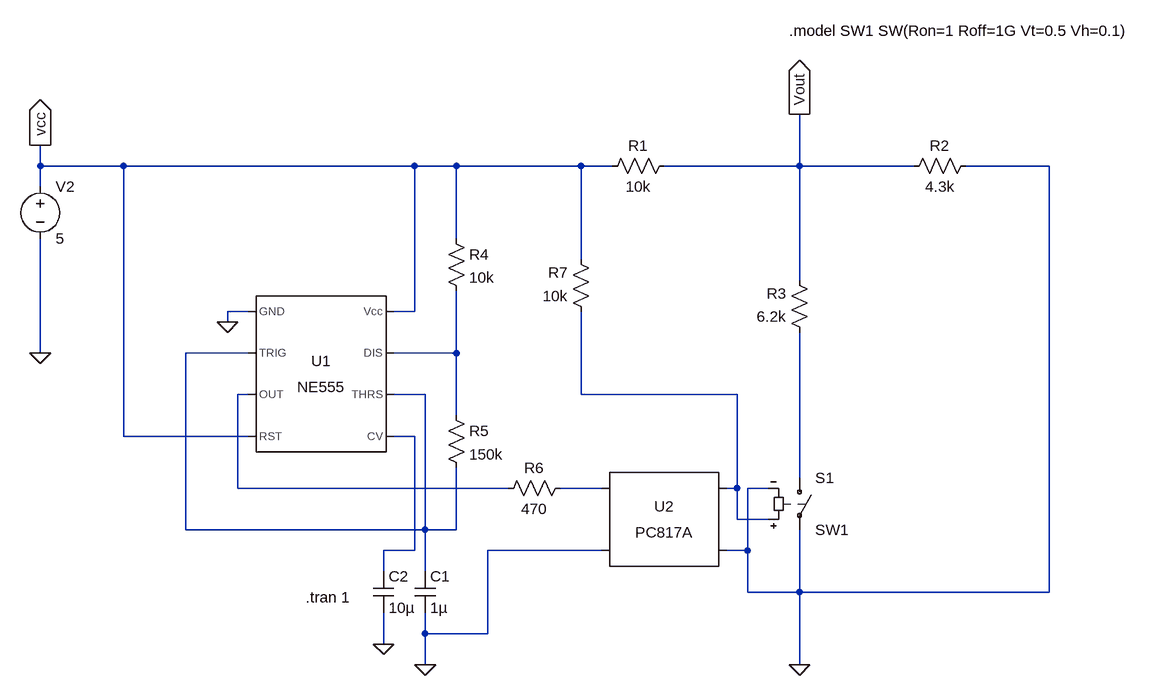
[diagram p0: schematic divider_switching.asc]
divider_switching.asc, the LTspice schematic file:
Version 4.1
SHEET 1 1304 996
WIRE -416 16 -416 -16
WIRE -288 16 -416 16
WIRE 160 16 -288 16
WIRE 224 16 160 16
WIRE 416 16 224 16
WIRE 464 16 416 16
WIRE 752 16 752 -64
WIRE 752 16 544 16
WIRE 928 16 752 16
WIRE 1136 16 1008 16
WIRE -416 48 -416 16
WIRE 224 128 224 16
WIRE 416 160 416 16
WIRE 752 192 752 16
WIRE -96 240 -128 240
WIRE 160 240 160 16
WIRE 160 240 128 240
WIRE -128 256 -128 240
WIRE -416 304 -416 128
WIRE -96 304 -192 304
WIRE 224 304 224 208
WIRE 224 304 128 304
WIRE -96 368 -112 368
WIRE 176 368 128 368
WIRE 416 368 416 240
WIRE 656 368 416 368
WIRE 224 400 224 304
WIRE -288 432 -288 16
WIRE -96 432 -288 432
WIRE 160 432 128 432
WIRE 752 496 752 272
WIRE -112 512 -112 368
WIRE 304 512 -112 512
WIRE 448 512 384 512
WIRE 656 512 656 368
WIRE 656 512 640 512
WIRE 704 512 672 512
WIRE 656 560 656 512
WIRE 704 560 656 560
WIRE -192 576 -192 304
WIRE 176 576 176 368
WIRE 176 576 -192 576
WIRE 224 576 224 480
WIRE 224 576 176 576
WIRE 160 608 160 432
WIRE 160 608 112 608
WIRE 448 608 272 608
WIRE 672 608 672 512
WIRE 672 608 640 608
WIRE 112 640 112 608
WIRE 176 640 176 576
WIRE 672 672 672 608
WIRE 752 672 752 576
WIRE 752 672 672 672
WIRE 1136 672 1136 16
WIRE 1136 672 752 672
WIRE 176 736 176 704
WIRE 272 736 272 608
WIRE 272 736 176 736
WIRE 112 752 112 704
WIRE 176 784 176 736
WIRE 752 784 752 672
FLAG 752 -64 Vout
IOPIN 752 -64 Out
FLAG -416 -16 vcc
IOPIN -416 -16 Out
FLAG 752 784 0
FLAG 176 784 0
FLAG 112 752 0
FLAG -128 256 0
FLAG -416 304 0
SYMBOL res 560 0 R90
WINDOW 0 0 56 VBottom 2
WINDOW 3 32 56 VTop 2
SYMATTR InstName R1
SYMATTR Value 10k
SYMBOL res 1024 0 R90
WINDOW 0 0 56 VBottom 2
WINDOW 3 32 56 VTop 2
SYMATTR InstName R2
SYMATTR Value 4.3k
SYMBOL res 768 288 R180
WINDOW 0 36 76 Left 2
WINDOW 3 36 40 Left 2
SYMATTR InstName R3
SYMATTR Value 6.2k
SYMBOL sw 752 480 R0
SYMATTR InstName S1
SYMATTR Value SW1
SYMBOL Misc\\NE555 16 336 R0
SYMATTR InstName U1
SYMBOL res 208 112 R0
SYMATTR InstName R4
SYMATTR Value 10k
SYMBOL res 208 384 R0
SYMATTR InstName R5
SYMATTR Value 150k
SYMBOL cap 160 640 R0
SYMATTR InstName C1
SYMATTR Value 1µ
SYMBOL cap 96 640 R0
SYMATTR InstName C2
SYMATTR Value 10µ
SYMBOL Optos\\PC817A 544 560 R0
SYMATTR InstName U2
SYMBOL res 400 496 R90
WINDOW 0 0 56 VBottom 2
WINDOW 3 32 56 VTop 2
SYMATTR InstName R6
SYMATTR Value 470
SYMBOL res 432 256 R180
WINDOW 0 36 76 Left 2
WINDOW 3 36 40 Left 2
SYMATTR InstName R7
SYMATTR Value 10k
SYMBOL voltage -416 32 R0
WINDOW 123 0 0 Left 0
WINDOW 39 0 0 Left 0
SYMATTR InstName V2
SYMATTR Value 5
TEXT -8 680 Left 2 !.tran 1
TEXT 736 -192 Left 2 !.model SW1 SW(Ron=1 Roff=1G Vt=0.5 Vh=0.1)

The netlist it stands for:
* divider_switching.asc
R1 Vout vcc 10k
R2 0 Vout 4.3k
R3 N006 Vout 6.2k
S1 N006 0 N004 0 SW1
X§U1 0 N001 N003 vcc N005 N001 N002 vcc NE555  ; pins GND TRIG OUT RST CV THRS DIS Vcc
R4 vcc N002 10k
R5 N002 N001 150k
C1 N001 0 1µ
C2 N005 0 10µ
X§U2 N007 0 N004 0 PC817 Igain=1m
R6 N007 N003 470
R7 N004 vcc 10k
V2 vcc 0 5
.tran 1
.model SW1 SW(Ron=1 Roff=1G Vt=0.5 Vh=0.1)
.lib NE555.sub
.lib PC817.sub
.backanno
.end